# EAGLE design UCube_v2_Tower2 (EAGLE 6.1)
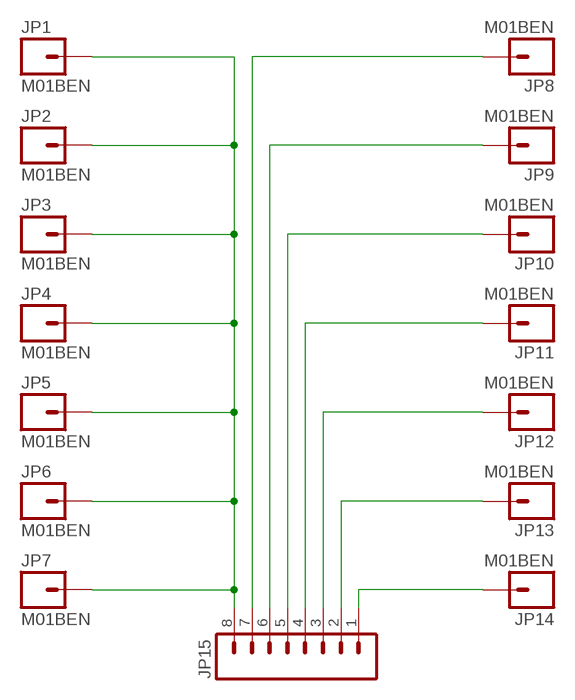
[diagram p0: schematic, sheet 1]

## Parts
JP1  M01BEN  [1X01-BEN]
JP2  M01BEN  [1X01-BEN]
JP3  M01BEN  [1X01-BEN]
JP4  M01BEN  [1X01-BEN]
JP5  M01BEN  [1X01-BEN]
JP6  M01BEN  [1X01-BEN]
JP7  M01BEN  [1X01-BEN]
JP8  M01BEN  [1X01-BEN]
JP9  M01BEN  [1X01-BEN]
JP10  M01BEN  [1X01-BEN]
JP11  M01BEN  [1X01-BEN]
JP12  M01BEN  [1X01-BEN]
JP13  M01BEN  [1X01-BEN]
JP14  M01BEN  [1X01-BEN]
JP15  M081X08  [1X08]

## Nets
N$1: JP1.1 JP2.1 JP3.1 JP4.1 JP5.1 JP6.1 JP7.1 JP15.8
N$2: JP8.1 JP15.7
N$3: JP9.1 JP15.6
N$4: JP10.1 JP15.5
N$5: JP11.1 JP15.4
N$6: JP12.1 JP15.3
N$7: JP13.1 JP15.2
N$8: JP14.1 JP15.1

## Library data of the parts
JP1-JP14 = SparkFun2:M01: Header 1 Standard 1-pin 0.1" header. Use with straight break away headers (SKU : PRT-00116), right angle break away headers (PRT-00553), swiss pins (PRT-00743), machine pins (PRT-00117), and female headers (PRT-00115).
JP15 = SparkFun2:M08: Header 8 Standard 8-pin 0.1" header. Use with straight break away headers (SKU : PRT-00116), right angle break away headers (PRT-00553), swiss pins (PRT-00743), machine pins (PRT-00117), and female headers (PRT-00115).

## Board
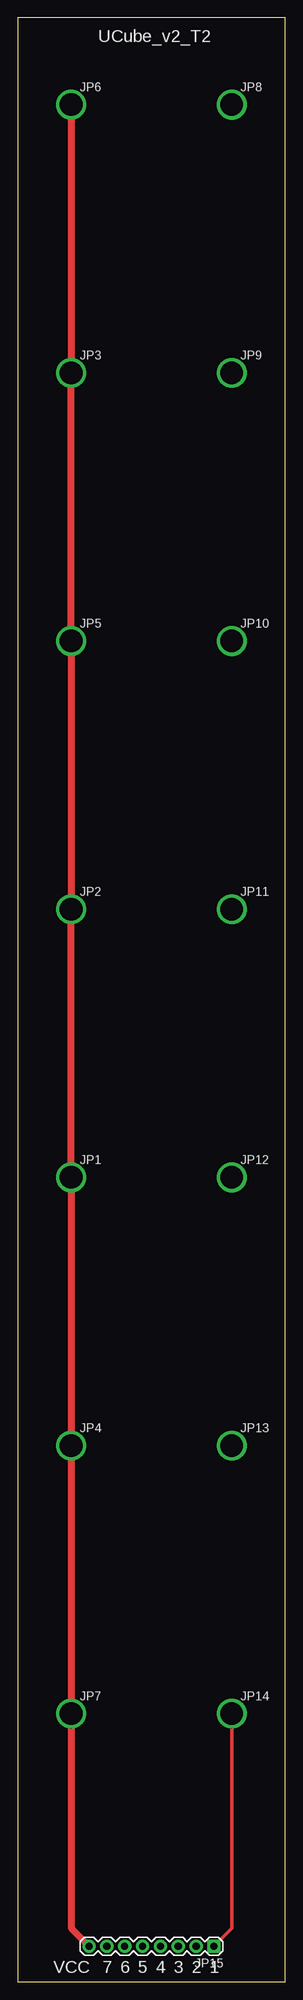
[diagram p1: board, top side]
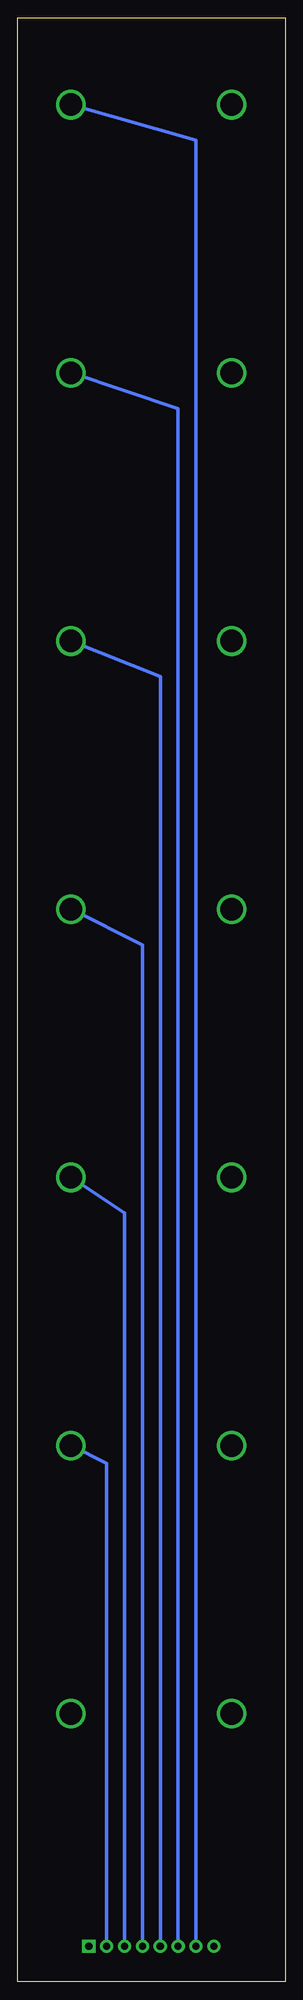
[diagram p2: board, bottom side, seen from below]

Size 38.08 x 279.07 mm. Coordinates in mm from the lower left corner, seen from the top.
Outline: 0,0 38.08,0 38.08,279.07 0,279.07 0,0
Copper layers (1*16): Top 0.035mm / dielectric 1.5mm / Bottom 0.035mm
Design rules: minimum track width 10mil, minimum drill 24mil, track to track 8mil, track to pad 8mil, pad to pad 8mil, via to via 8mil, smd to smd 8mil, copper to edge 40mil, drill to drill 8mil, minimum pad ring 10mil, minimum via ring 8mil, stop-mask expansion 4mil, vias tented up to drill 0mil, thermal gap 10mil

### Footprints (pad centres in the part's own frame; a part is rotated, then mirrored left to right if it is on the bottom)
1X01-BEN = drill 3.2: 1 0,0
1X08 = drill 1.016 pad 1.88 square: 1 0,0 | drill 1.016 pad 1.88: 2 2.54,0; 3 5.08,0; 4 7.62,0; 5 10.16,0; 6 12.7,0; 7 15.24,0; 8 17.78,0

### Placement (x,y rotation side)
JP1  7.62,114.3 0 top
JP2  7.62,152.4 0 top
JP3  7.62,228.6 0 top
JP4  7.62,76.2 0 top
JP5  7.62,190.5 0 top
JP6  7.62,266.7 0 top
JP7  7.62,38.1 0 top
JP8  30.48,266.7 0 top
JP9  30.48,228.6 0 top
JP10  30.48,190.5 0 top
JP11  30.48,152.4 0 top
JP12  30.48,114.3 0 top
JP13  30.48,76.2 0 top
JP14  30.48,38.1 0 top
JP15  27.94,5.08 180 top

### Tracks (layer width: path | path; a pad name or v marks a point on that pad's centre or on a via)
N$1
  Top 1.016: JP6.1 JP3.1 JP5.1 JP2.1 JP1.1 JP4.1 JP7.1 7.62,7.62 JP15.8
N$2
  Bottom 0.508: JP15.7 12.7,261.62 JP8.1
N$3
  Bottom 0.508: JP15.6 15.24,223.52 JP9.1
N$4
  Bottom 0.508: JP15.5 17.78,185.42 JP10.1
N$5
  Bottom 0.508: JP15.4 20.32,147.32 JP11.1
N$6
  Bottom 0.508: JP15.3 22.86,109.22 JP12.1
N$7
  Bottom 0.508: JP15.2 25.4,73.66 JP13.1
N$8
  Top 0.508: JP15.1 30.48,7.62 JP14.1

### Text on the board
tPlace: UCube_v2_T2 | VCC | 7 | 6 | 5 | 4 | 3 | 2 | 1